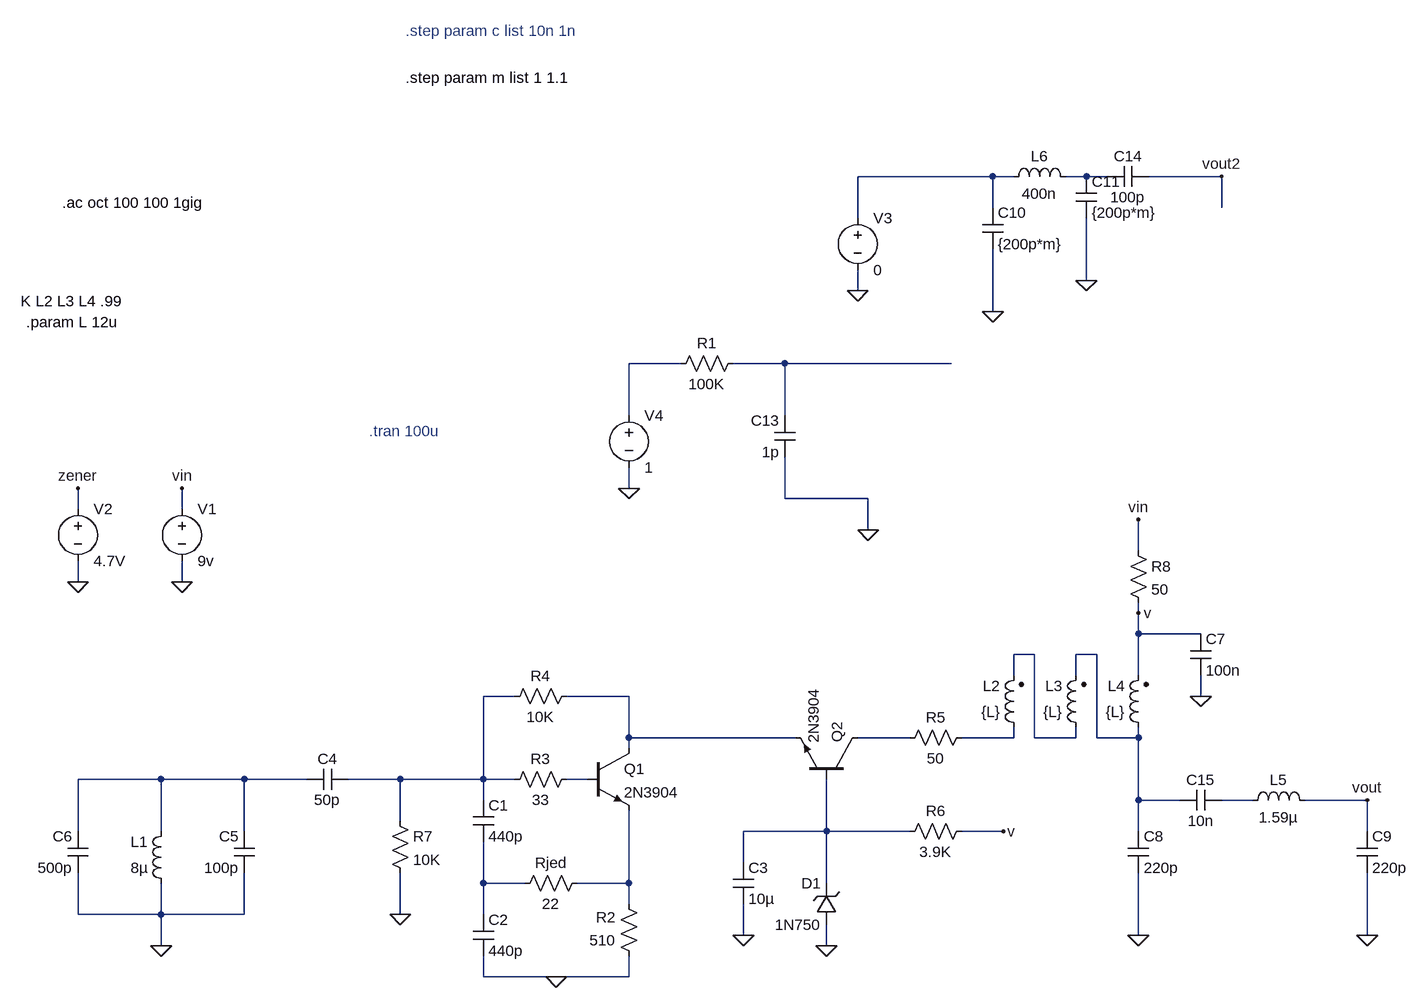
[diagram p0: schematic VCO.asc]
VCO.asc, the LTspice schematic file:
Version 4
SHEET 1 1488 704
WIRE 784 -544 576 -544
WIRE 816 -544 784 -544
WIRE 928 -544 896 -544
WIRE 960 -544 928 -544
WIRE 1136 -544 1024 -544
WIRE 784 -496 784 -544
WIRE 1136 -496 1136 -544
WIRE 576 -480 576 -544
WIRE 928 -384 928 -480
WIRE 576 -368 576 -400
WIRE 784 -336 784 -432
WIRE 304 -256 224 -256
WIRE 464 -256 384 -256
WIRE 720 -256 464 -256
WIRE 224 -176 224 -256
WIRE 464 -176 464 -256
WIRE 224 -64 224 -96
WIRE 464 -48 464 -112
WIRE 592 -48 464 -48
WIRE -624 -32 -624 -64
WIRE -464 -32 -464 -64
WIRE 592 0 592 -48
WIRE 1008 32 1008 -16
WIRE -624 80 -624 48
WIRE -464 80 -464 48
WIRE 1008 128 1008 112
WIRE 1008 160 1008 128
WIRE 1104 160 1008 160
WIRE 848 192 816 192
WIRE 944 192 912 192
WIRE 816 224 816 192
WIRE 912 224 912 192
WIRE 1008 224 1008 160
WIRE 48 256 0 256
WIRE 224 256 128 256
WIRE 1104 256 1104 224
WIRE 224 320 224 256
WIRE 480 320 224 320
WIRE 656 320 576 320
WIRE 816 320 816 304
WIRE 816 320 736 320
WIRE 848 320 848 192
WIRE 912 320 912 304
WIRE 912 320 848 320
WIRE 944 320 944 192
WIRE 1008 320 1008 304
WIRE 1008 320 944 320
WIRE 224 336 224 320
WIRE -496 384 -624 384
WIRE -368 384 -496 384
WIRE -272 384 -368 384
WIRE -128 384 -208 384
WIRE 0 384 0 256
WIRE 0 384 -128 384
WIRE 48 384 0 384
WIRE 160 384 128 384
WIRE 0 416 0 384
WIRE 1008 416 1008 320
WIRE 1072 416 1008 416
WIRE 1184 416 1136 416
WIRE 1360 416 1264 416
WIRE -128 448 -128 384
WIRE -624 464 -624 384
WIRE -496 464 -496 384
WIRE -368 464 -368 384
WIRE 528 464 528 384
WIRE 528 464 400 464
WIRE 656 464 528 464
WIRE 800 464 736 464
WIRE 1008 464 1008 416
WIRE 1360 464 1360 416
WIRE 400 512 400 464
WIRE 0 544 0 480
WIRE 64 544 0 544
WIRE 224 544 224 432
WIRE 224 544 144 544
WIRE 528 544 528 464
WIRE 224 576 224 544
WIRE -624 592 -624 528
WIRE -496 592 -496 544
WIRE -496 592 -624 592
WIRE -368 592 -368 528
WIRE -368 592 -496 592
WIRE -128 592 -128 528
WIRE 0 592 0 544
WIRE 400 624 400 576
WIRE 1008 624 1008 528
WIRE 1360 624 1360 528
WIRE -496 640 -496 592
WIRE 528 640 528 608
WIRE 0 688 0 656
WIRE 112 688 0 688
WIRE 224 688 224 656
WIRE 224 688 112 688
FLAG -496 640 0
FLAG 112 688 0
FLAG -128 592 0
FLAG 1104 256 0
FLAG 1008 128 v
FLAG 800 464 v
FLAG 1008 624 0
FLAG 1360 624 0
FLAG 1360 416 vout
FLAG -464 80 0
FLAG -464 -64 vin
FLAG 1008 -16 vin
FLAG -624 80 0
FLAG -624 -64 zener
FLAG 400 624 0
FLAG 528 640 0
FLAG 784 -336 0
FLAG 928 -384 0
FLAG 1136 -544 vout2
FLAG 576 -368 0
FLAG 592 0 0
FLAG 224 -64 0
SYMBOL npn 160 336 R0
SYMATTR InstName Q1
SYMATTR Value 2N3904
SYMBOL npn 576 384 M270
SYMATTR InstName Q2
SYMATTR Value 2N3904
SYMBOL cap -16 416 R0
SYMATTR InstName C1
SYMATTR Value 440p
SYMBOL cap -16 592 R0
SYMATTR InstName C2
SYMATTR Value 440p
SYMBOL cap 384 512 R0
SYMATTR InstName C3
SYMATTR Value 10µ
SYMBOL res 160 528 R90
WINDOW 0 0 56 VBottom 2
WINDOW 3 32 56 VTop 2
SYMATTR InstName Rjed
SYMATTR Value 22
SYMBOL res 240 672 R180
WINDOW 0 36 76 Left 2
WINDOW 3 36 40 Left 2
SYMATTR InstName R2
SYMATTR Value 510
SYMBOL res 144 368 R90
WINDOW 0 0 56 VBottom 2
WINDOW 3 32 56 VTop 2
SYMATTR InstName R3
SYMATTR Value 33
SYMBOL res 144 240 R90
WINDOW 0 0 56 VBottom 2
WINDOW 3 32 56 VTop 2
SYMATTR InstName R4
SYMATTR Value 10K
SYMBOL res 752 304 R90
WINDOW 0 0 56 VBottom 2
WINDOW 3 32 56 VTop 2
SYMATTR InstName R5
SYMATTR Value 50
SYMBOL res 752 448 R90
WINDOW 0 0 56 VBottom 2
WINDOW 3 32 56 VTop 2
SYMATTR InstName R6
SYMATTR Value 3.9K
SYMBOL cap -208 368 R90
WINDOW 0 0 32 VBottom 2
WINDOW 3 32 32 VTop 2
SYMATTR InstName C4
SYMATTR Value 50p
SYMBOL cap -352 528 R180
WINDOW 0 24 56 Left 2
WINDOW 3 24 8 Left 2
SYMATTR InstName C5
SYMATTR Value 100p
SYMBOL cap -608 528 R180
WINDOW 0 24 56 Left 2
WINDOW 3 24 8 Left 2
SYMATTR InstName C6
SYMATTR Value 500p
SYMBOL ind -480 560 R180
WINDOW 0 36 80 Left 2
WINDOW 3 36 40 Left 2
SYMATTR InstName L1
SYMATTR Value 8µ
SYMBOL res -144 432 R0
SYMATTR InstName R7
SYMATTR Value 10K
SYMBOL ind2 832 320 R180
WINDOW 0 36 80 Left 2
WINDOW 3 36 40 Left 2
SYMATTR InstName L2
SYMATTR Value {L}
SYMATTR Type ind
SYMBOL ind2 928 320 R180
WINDOW 0 36 80 Left 2
WINDOW 3 36 40 Left 2
SYMATTR InstName L3
SYMATTR Value {L}
SYMATTR Type ind
SYMBOL ind2 1024 320 R180
WINDOW 0 36 80 Left 2
WINDOW 3 36 40 Left 2
SYMATTR InstName L4
SYMATTR Value {L}
SYMATTR Type ind
SYMBOL res 992 16 R0
SYMATTR InstName R8
SYMATTR Value 50
SYMBOL cap 1088 160 R0
SYMATTR InstName C7
SYMATTR Value 100n
SYMBOL cap 992 464 R0
SYMATTR InstName C8
SYMATTR Value 220p
SYMBOL cap 1344 464 R0
SYMATTR InstName C9
SYMATTR Value 220p
SYMBOL ind 1168 432 R270
WINDOW 0 32 56 VTop 2
WINDOW 3 5 56 VBottom 2
SYMATTR InstName L5
SYMATTR Value 1.59µ
SYMBOL voltage -464 -48 R0
SYMATTR InstName V1
SYMATTR Value 9v
SYMBOL voltage -624 -48 R0
SYMATTR InstName V2
SYMATTR Value 4.7V
SYMBOL zener 544 608 R180
WINDOW 0 24 64 Left 2
WINDOW 3 24 0 Left 2
SYMATTR InstName D1
SYMATTR Value 1N750
SYMBOL cap 768 -496 R0
SYMATTR InstName C10
SYMATTR Value {200p*m}
SYMBOL cap 912 -544 R0
SYMATTR InstName C11
SYMATTR Value {200p*m}
SYMBOL ind 800 -528 R270
WINDOW 0 32 56 VTop 2
WINDOW 3 5 56 VBottom 2
SYMATTR InstName L6
SYMATTR Value 400n
SYMBOL voltage 576 -496 R0
SYMATTR InstName V3
SYMATTR Value 0
SYMATTR Value2 AC 1
SYMBOL cap 480 -112 R180
WINDOW 0 24 56 Left 2
WINDOW 3 24 8 Left 2
SYMATTR InstName C13
SYMATTR Value 1p
SYMBOL voltage 224 -192 R0
SYMATTR InstName V4
SYMATTR Value 1
SYMATTR Value2 AC 1
SYMBOL cap 1024 -560 R90
WINDOW 0 0 32 VBottom 2
WINDOW 3 32 32 VTop 2
SYMATTR InstName C14
SYMATTR Value 100p
SYMBOL cap 1136 400 R90
WINDOW 0 0 32 VBottom 2
WINDOW 3 32 32 VTop 2
SYMATTR InstName C15
SYMATTR Value 10n
SYMBOL res 400 -272 R90
WINDOW 0 0 56 VBottom 2
WINDOW 3 32 56 VTop 2
SYMATTR InstName R1
SYMATTR Value 100K
TEXT -712 -352 Left 2 !K L2 L3 L4 .99
TEXT -704 -320 Left 2 !.param L 12u
TEXT -176 -152 Left 2 ;.tran 100u
TEXT -648 -504 Left 2 !.ac oct 100 100 1gig
TEXT -120 -768 Left 2 ;.step param c list 10n 1n
TEXT -120 -696 Left 2 !.step param m list 1 1.1

The netlist it stands for:
* VCO.asc
Q1 N008 N012 N016 0 2N3904
Q2 N009 N014 N008 0 2N3904
C1 N007 N015 440p
C2 N015 0 440p
C3 N014 0 10µ
Rjed N016 N015 22
R2 0 N016 510
R3 N012 N007 33
R4 N008 N007 10K
R5 N010 N009 50
R6 v N014 3.9K
C4 N007 N011 50p
C5 0 N011 100p
C6 0 N011 500p
L1 0 N011 8µ
R7 N007 0 10K
L2 N010 N005 {L}
L3 N005 N006 {L}
L4 N006 v {L}
R8 vin v 50
C7 v 0 100n
C8 N006 0 220p
C9 vout 0 220p
L5 N013 vout 1.59µ
V1 vin 0 9v
V2 zener 0 4.7V
D1 0 N014 1N750
C10 N001 0 {200p*m}
C11 N002 0 {200p*m}
L6 N001 N002 400n
V3 N001 0 0 AC 1
C13 0 N004 1p
V4 N003 0 1 AC 1
C14 vout2 N002 100p
C15 N013 N006 10n
R1 N004 N003 100K
.model D D
.lib standard.dio
.model NPN NPN
.model PNP PNP
.lib standard.bjt
K L2 L3 L4 .99
.param L 12u
* .tran 100u
.ac oct 100 100 1gig
* .step param c list 10n 1n
.step param m list 1 1.1
.backanno
.end